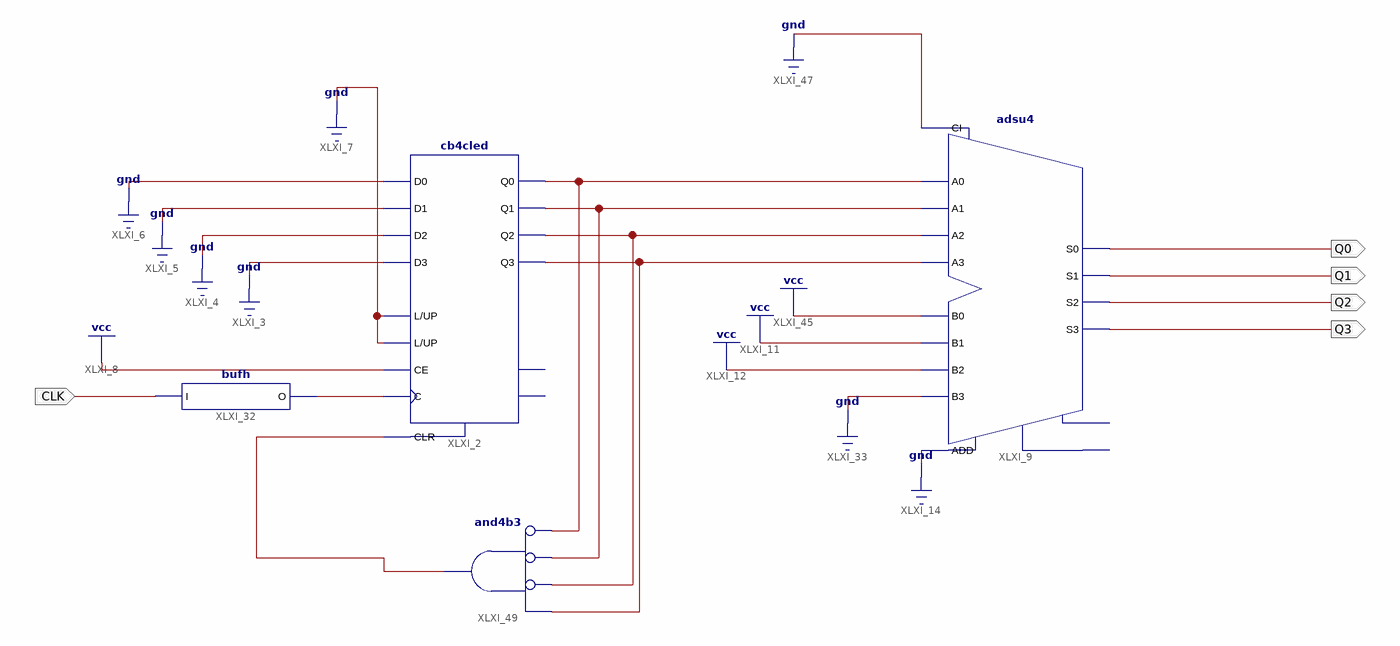
[diagram p0: schematic sheet 1]
// Xilinx ISE schematic countDown9_0.sch (spartan6) as structural Verilog: 4 symbols, 5 ports
module countDown9_0 (
  input  CLK,
  output Q0,
  output Q1,
  output Q2,
  output Q3
);

  wire O0, O1, O2, O3, XLXN_66, XLXN_74;

  cb4cled XLXI_2 (
    .C(XLXN_66), .CE(1'b1), .CLR(XLXN_74), .D0(1'b0), .D1(1'b0), .D2(1'b0), .D3(1'b0), .L(1'b0), .UP(1'b0),
    .Q0(O0), .Q1(O1), .Q2(O2), .Q3(O3));  // open: CEO, TC
  adsu4 XLXI_9 (
    .A0(O0), .A1(O1), .A2(O2), .A3(O3), .ADD(1'b0), .B0(1'b1), .B1(1'b1), .B2(1'b1), .B3(1'b0), .CI(1'b0),
    .S0(Q0), .S1(Q1), .S2(Q2), .S3(Q3));  // open: CO, OFL
  bufh XLXI_32 (.I(CLK), .O(XLXN_66));
  and XLXI_49 (XLXN_74, ~O0, ~O1, ~O2, O3);  // and4b3
endmodule
